# Altium project unity_gain_buffer(lm358dr).PrjPcb
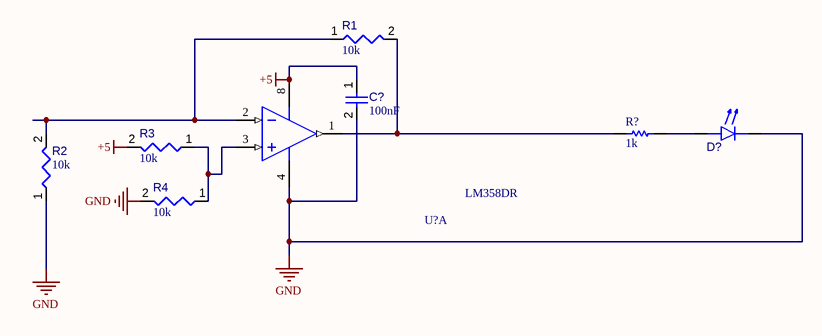
[diagram p0: Sheet2.SchDoc]
1 sheet, 8 parts. Net scope: global (net labels, ports and power ports of the same name join across sheets).

## Sheet Sheet2.SchDoc
size A; SheetNumber: 1; SheetTotal: 1

### Parts
C?  value 100nF  [CAPC0402(1005)60_L]  (hidden comment: Capacitor 100nF +/-20% 50V 0402)
D?  LED  (value not drawn)
R1  value 10k  [RESC0402(1005)_L]  (hidden comment: Resistor 10K  +/-1 % 0402 63 mW)
R2  value 10k  [RESC0402(1005)_L]  (hidden comment: Resistor 10K  +/-1 % 0402 63 mW)
R3  value 10k  [RESC0402(1005)_L]  (hidden comment: Resistor 10K  +/-1 % 0402 63 mW)
R4  value 10k  [RESC0402(1005)_L]  (hidden comment: Resistor 10K  +/-1 % 0402 63 mW)
R?  value 1k  [RESC2013X70X40ML20T20]  (hidden comment: Resistor 1k +/-1% 0805 125 mW)
U?  LM358DR  [D0008A_L]  (part A of 2)

### Nets
+5: C?.1 R3.2 U?.8(VCC)
GND: C?.2 D?.1(K) R2.1 R4.2 U?.4(GND)
NetD?_2: D?.2(A) R?.2
NetR1_1: R1.1 R2.2 U?.2(1IN-)
NetR1_2: R1.2 R?.1 U?.1(1OUT)
NetR3_1: R3.1 R4.1 U?.3(1IN+)

### Library data of the parts
C? = CMP-001-00067-3: Chip Capacitor, 100nF +/-20%, 50V, 0402, Thickness 0.6 mm; Tolerance: 10%; Min Operating Temperature: -55°C; Pins: 2; Case/Package: 0402; Max Operating Temperature: 85°C; Voltage Rating: 50V; Mounting Technology: SMT
D? = LED: Light-emitting Diode; Component Type: LED
R1-R4 = CMP-009-00149-3: Chip Resistor, 10 kOhms, +/-1 %, 63 mW, -55 to 125 degC, 0402; Power: 63mW; Tolerance: 1%; Min Operating Temperature: -55°C; Case/Package: 0402; Max Operating Temperature: 155°C; Pins: 2
R? = CMP-009-00010-5: Chip Resistor, 1 KOhm, +/- 1%, 0.125 W, -55 to 155 degC, 0805 (2013 Metric); Power: 125mW; Voltage Rating: 150V; Tolerance: 1%; RoHS Compliant: True; Mounting Technology: SM; Pins: 2; Case/Package: 0805; Max Operating Temperature: 155°C; Min Operating Temperature: -55°C
U? = CMP-014-00024-2: Dual Operational Amplifier, 3 to 32 V, 0 to 70 degC, 8-Pin SOIC (D), Green (RoHS & no Sb/Br), Tape and Reel; Manufacturer: Texas Instruments (TI); Channels: 2; Min Supply Voltage: 1.5V; Max Supply Voltage: 16V; Package Version: 4040047-3/M, 06/2011; Common Mode Rejection Ratio: 65dB; Nominal Dual Supply Voltage: 12V; Output Current: 30mA; Slew Rate: 0.3V/us; Unity Gain Bandwidth Product: 700KHz; Nominal Supply Current: 1.2mA; Nominal Voltage Gain: 100dB; Packaging: CutTape; Manufacturer URL: http://www.ti.com/; RoHS Compliant: True; Datasheet Version: SLOS068T, 04/2015; Min Dual Supply Voltage: 1.5V; Max Operating Temperature: 70°C; Package Description: 8-Pin Small Outline Integrated Circuit, Body 4.9 x 3.9 mm, Pitch 1.27 mm; Package Reference: D0008A; Max Dual Supply Voltage: 16V; Nominal Supply Voltage: 12V; Mounting Technology: SM; Datasheet URL: http://www.ti.com/lit/ds/symlink/lm358.pdf; Case/Package: SOIC; Package URL: http://www.ti.com/lit/ml/msoi002j/msoi002j.pdf; Min Operating Temperature: 0°C; Pins: 8; Package Quantity: 1; Nominal Gain Bandwith Product: 700KHz